# EAGLE design radio2 (EAGLE 7.7.0)
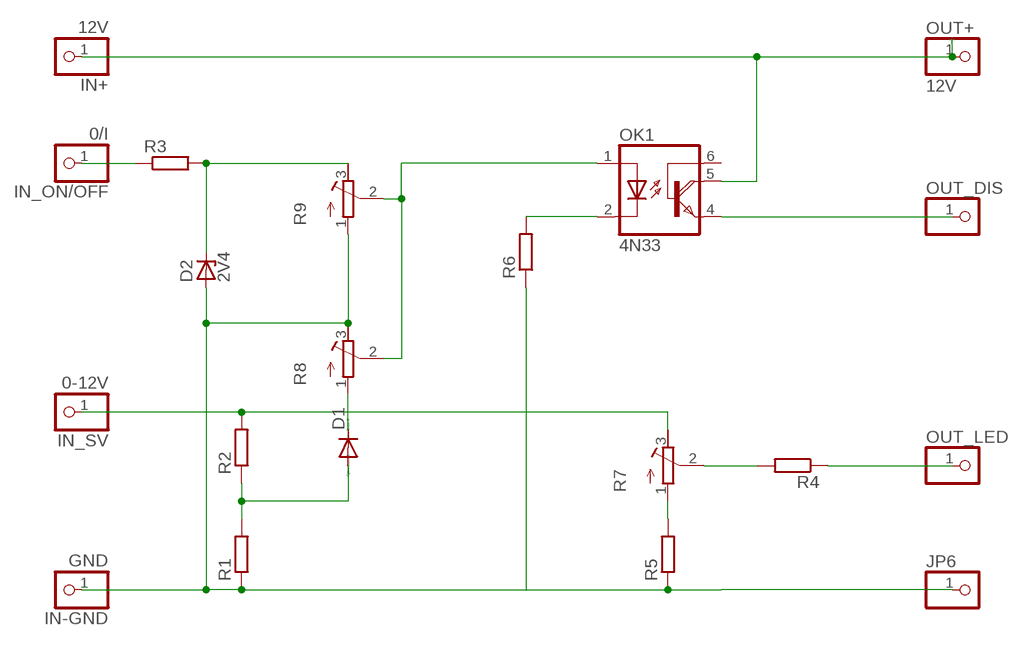
[diagram p0: schematic, sheet 1]

## Parts
D1  1N4004  [DO41-10]
D2  2V4  1N821  [DO35Z10]
IN+  12V  PINHD-1X1  [1X01]
IN-GND  GND  PINHD-1X1  [1X01]
IN_ON/OFF  0/I  PINHD-1X1  [1X01]
IN_SV  0-12V  PINHD-1X1  [1X01]
JP6  PINHD-1X1  [1X01]
OK1  4N33  [DIL06]
OUT+  12V  PINHD-1X1  [1X01]
OUT_DIS  PINHD-1X1  [1X01]
OUT_LED  PINHD-1X1  [1X01]
R1  R-EU_0207/7  [0207/7]
R2  R-EU_0207/7  [0207/7]
R3  R-EU_0207/7  [0207/7]
R4  R-EU_0207/7  [0207/7]
R5  R-EU_0207/7  [0207/7]
R6  R-EU_0207/7  [0207/7]
R7  R-TRIMM3339P  [RTRIM3339P]
R8  R-TRIMM3339P  [RTRIM3339P]
R9  R-TRIMM3339P  [RTRIM3339P]

## Nets
N$1: D2.A IN-GND.1 JP6.1 R1.1 R5.1 R6.1 R8.3(E) R9.1(A)
N$2: D1.A R1.2 R2.1
N$3: IN_SV.1 R2.2 R7.3(E)
N$4: IN_ON/OFF.1 R3.1
N$5: OK1.2(C) R6.2
N$6: R5.2 R7.1(A)
N$7: R4.2 R7.2(S)
N$8: IN+.1 OK1.5(COL) OUT+.1
N$9: OUT_LED.1 R4.1
N$10: OK1.4(E) OUT_DIS.1
N$11: D1.C R8.1(A)
N$12: D2.C R3.2 R9.3(E)
N$13: OK1.1(A) R8.2(S) R9.2(S)
Unconnected: OK1.6(B)

## Library data of the parts
D1 = diode:1N4004: DIODE general purpose rectifier, 1 A
D2 = diode:1N821: Reference DIODE temperature compensated, 6,2 V
IN+ IN-GND IN_ON/OFF IN_SV JP6 OUT+ OUT_DIS OUT_LED = pinhead:PINHD-1X1: PIN HEADER
OK1 = optocoupler:4N33: MOTOROLA OPTO COUPLER; MF: VISHAY/TELEFUNKEN; MPN: 4N33; OC_FARNELL: 1469601; OC_NEWARK: 88K1390
R1-R6 = rcl:R-EU_: RESISTOR, European symbol
R7-R9 = resistor:R-TRIMM: Trimm resistor

## Board
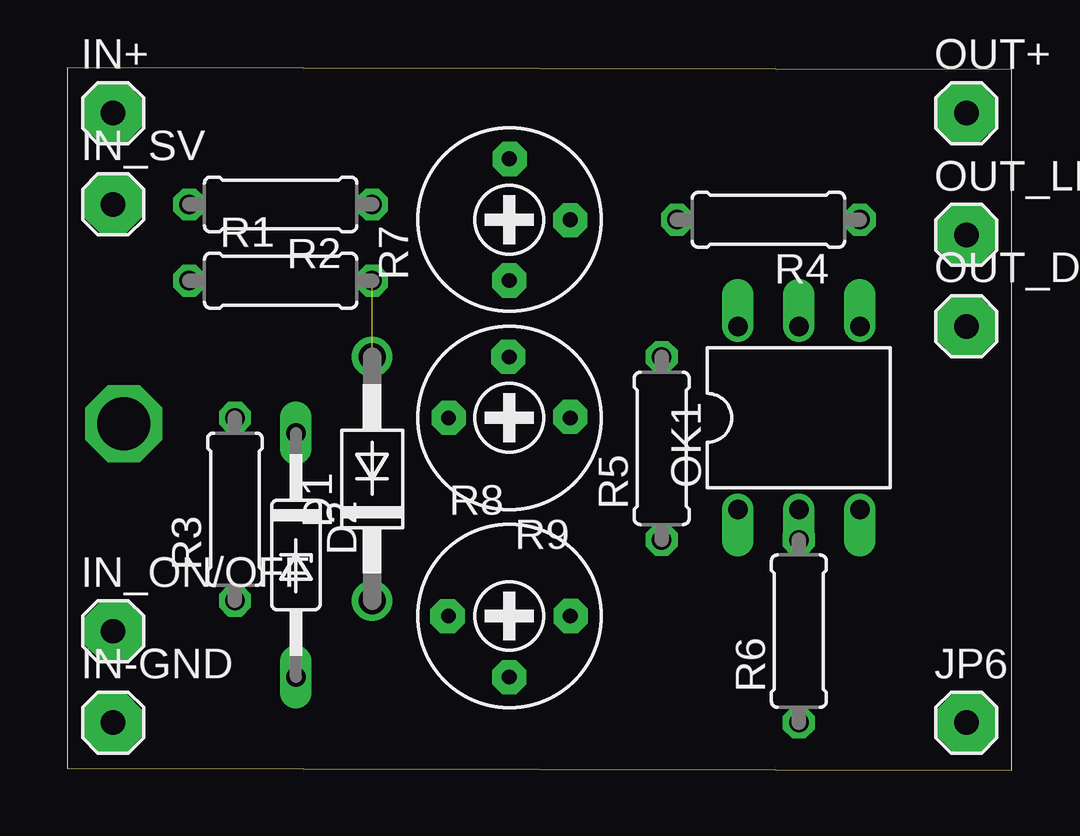
[diagram p1: board, top side]
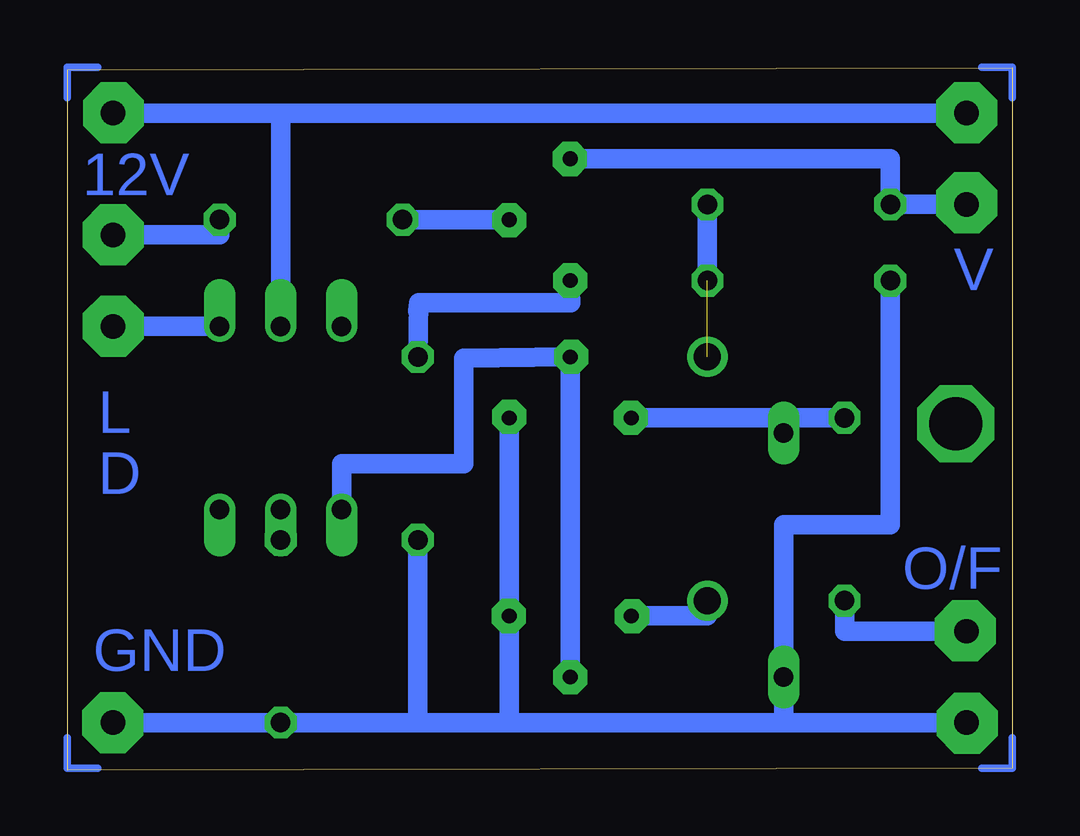
[diagram p2: board, bottom side, seen from below]

Size 39.35 x 29.28 mm. Coordinates in mm from the lower left corner, seen from the top.
Outline: 0,0.08 39.35,0 39.35,29.2 0,29.28 0,0.08
Copper layers (1*16): Top 0.035mm / dielectric 1.5mm / Bottom 0.035mm
Design rules "default": minimum track width 10mil, minimum drill 24mil, track to track 8mil, track to pad 8mil, pad to pad 8mil, via to via 8mil, smd to smd 8mil, copper to edge 40mil, drill to drill 8mil, minimum pad ring 10mil, minimum via ring 8mil, stop-mask expansion 4mil, vias tented up to drill 0mil, thermal gap 10mil

### Footprints (pad centres in the part's own frame; a part is rotated, then mirrored left to right if it is on the bottom)
DO41-10 = drill 1.118: A 5.08,0; C -5.08,0
DO35Z10 = drill 0.813 long: A 5.08,0; C -5.08,0
1X01 = drill 1.016 octagon: 1 0,0
DIL06 = drill 0.813 offset: 1 -2.54,-3.81; 2 0,-3.81; 3 2.54,-3.81; 4 2.54,3.81; 5 0,3.81; 6 -2.54,3.81
0207/7 = drill 0.813 octagon: 1 -3.81,0; 2 3.81,0
RTRIM3339P = drill 0.61: 1 -2.54,0; 2 0,-2.54; 3 2.54,0

### Placement (x,y rotation side)
D1  12.7,12.15 90 top
D2  9.53,8.97 270 top
IN+  1.91,27.39 0 top
IN-GND  1.91,1.99 0 top
IN_ON/OFF  1.91,5.8 0 top
IN_SV  1.91,23.58 0 top
JP6  37.47,1.99 0 top
OK1  30.48,14.69 0 top
OUT+  37.47,27.39 0 top
OUT_DIS  37.47,18.5 0 top
OUT_LED  37.47,22.31 0 top
R1  8.89,20.4 0 top
R2  8.89,23.58 180 top
R3  6.99,10.88 90 top
R4  29.21,22.94 180 top
R5  24.77,13.42 90 top
R6  30.48,5.8 90 top
R7  18.41,22.94 90 top
R8  18.41,6.43 0 top
R9  18.41,14.69 180 top

### Tracks (layer width: path | path; a pad name or v marks a point on that pad's centre or on a via)
N$1
  Bottom 0.813: R9.1 R8.3 20.95,1.99 | 9.53,1.99 D2.A 9.53,10.24 5.08,10.24 R1.1 | 20.95,1.99 9.53,1.99 | 9.53,1.99 IN-GND.1 | 20.95,1.99 24.77,1.99 | 24.77,1.99 R5.1 | 24.77,1.99 R6.1 JP6.1
N$2  (1 unrouted)
  Bottom 0.813: R2.1 R1.2
N$3
  Bottom 0.813: IN_SV.1 R2.2 5.08,25.48 R7.3
N$4
  Bottom 0.813: IN_ON/OFF.1 6.99,5.8 R3.1
N$5
  Bottom 0.813: OK1.2 R6.2
N$6
  Bottom 0.813: 24.77,19.13 24.73,19.49 | R7.1 18.44,20.4 18.4,19.49 24.73,19.49 | 24.73,19.49 R5.2
N$7
  Bottom 0.813: R4.2 R7.2
N$8
  Bottom 0.813: OK1.5 30.48,27.39 | 30.48,27.39 IN+.1 | OUT+.1 30.48,27.39
N$9
  Bottom 0.813: R4.1 33.02,22.31 OUT_LED.1
N$10
  Bottom 0.813: OUT_DIS.1 OK1.4
N$11
  Bottom 0.813: D1.C 12.7,6.43 R8.1
N$12
  Bottom 0.813: R9.3 9.53,14.69 | 9.53,14.69 R3.2 | D2.C 9.53,14.69
N$13
  Bottom 0.813: R8.2 R9.2 22.86,17.18 22.86,12.78 27.94,12.78 OK1.1
N$14  (via drill 0.5 pad 2.54)
  other vias: 1.9,23.64
N$15  (via drill 0.5 pad 2.54)
  other vias: 1.9,27.4
N$16  (via drill 0.5 pad 2.54)
  other vias: 1.96,5.81
N$17  (via drill 0.5 pad 2.54)
  other vias: 1.88,1.96
N$18  (via drill 0.5 pad 2.54)
  other vias: 37.48,1.99
N$19  (via drill 0.5 pad 2.54)
  other vias: 37.47,22.31
N$20  (via drill 0.5 pad 2.54)
  other vias: 37.46,18.51
N$21  (via drill 0.5 pad 2.54)
  other vias: 37.45,27.39
N$22  (via drill 2.2 pad 2.54)
  other vias: 2.35,14.45
N$23  (via drill 0.5 pad 1.42)
  other vias: 18.43,25.47
N$24  (via drill 0.5 pad 1.42)
  other vias: 20.96,22.92
N$25  (via drill 0.5 pad 1.42)
  other vias: 18.41,20.41
N$26  (via drill 0.5 pad 1.42)
  other vias: 15.89,14.69
N$27  (via drill 0.5 pad 1.42)
  other vias: 18.38,17.23
N$28  (via drill 0.5 pad 1.42)
  other vias: 20.95,14.73
N$29  (via drill 0.5 pad 1.42)
  other vias: 15.84,6.41
N$30  (via drill 0.5 pad 1.42)
  other vias: 20.98,6.43
N$31  (via drill 0.5 pad 1.42)
  other vias: 18.41,3.87
N$32
  Bottom 0.305: 1.27,29.29 0,29.29 0,28.02
N$33
  Bottom 0.305: 0,1.35 0,0.08 1.27,0.08
N$34
  Bottom 0.305: 39.37,28.02 39.37,29.29 38.1,29.29
N$35
  Bottom 0.305: 38.1,0.08 39.37,0.08 39.37,1.35

### Text on the board
Bottom: 12V | V | L | D | O/F | GND